# Altium schematic sheet 24VBuckBoostConverterSM.SchDoc
size A; SheetNumber: 5; SheetTotal: 7; SPICEModelCacheDWFIXPQE: <root> / <DocumentId>DWFIXPQE</DocumentId> / </root>
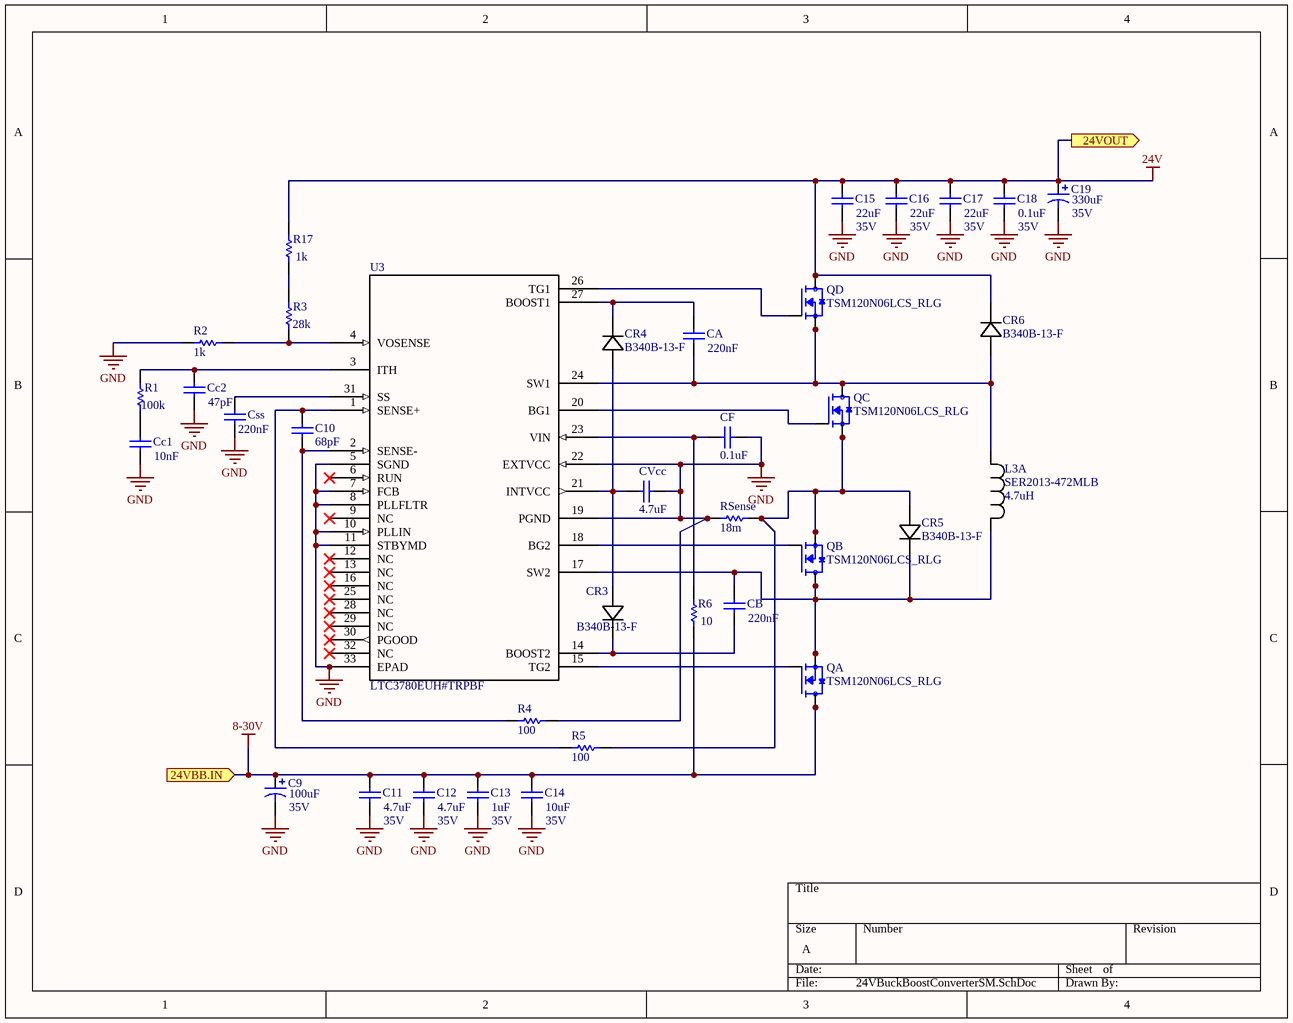
[diagram p0: 24VBuckBoostConverterSM.SchDoc]

## Parts
C9  value 100uF  Voltage Rating: 35V  [RB7.6-15]  (hidden comment: Cap Pol1)
C10  value 68pF  [RAD-0.1]  (hidden comment: Cap)
C11  value 4.7uF  Voltage Rating: 35V  [RAD-0.3]  (hidden comment: Cap)
C12  value 4.7uF  Voltage Rating: 35V  [RAD-0.3]  (hidden comment: Cap)
C13  value 1uF  Voltage Rating: 35V  [RAD-0.3]  (hidden comment: Cap)
C14  value 10uF  Voltage Rating: 35V  [RAD-0.3]  (hidden comment: Cap)
C15  value 22uF  Voltage Rating: 35V  [RAD-0.3]  (hidden comment: Cap)
C16  value 22uF  Voltage Rating: 35V  [RAD-0.3]  (hidden comment: Cap)
C17  value 22uF  Voltage Rating: 35V  [RAD-0.3]  (hidden comment: Cap)
C18  value 0.1uF  Voltage Rating: 35V  [RAD-0.3]  (hidden comment: Cap)
C19  value 330uF  Voltage Rating: 35V  [RB7.6-15]  (hidden comment: Cap Pol1)
CA  value 220nF  [RAD-0.1]  (hidden comment: Cap)
CB  value 220nF  [RAD-0.1]  (hidden comment: Cap)
Cc1  value 10nF  [RAD-0.1]  (hidden comment: Cap)
Cc2  value 47pF  [RAD-0.2]  (hidden comment: Cap)
CF  value 0.1uF  [RAD-0.1]  (hidden comment: Cap)
CR3  B340B-13-F  [B340A-13-F]
CR4  B340B-13-F  [B340A-13-F]
CR5  B340B-13-F  [B340A-13-F]
CR6  B340B-13-F  [B340A-13-F]
Css  value 220nF  [RAD-0.1]  (hidden comment: Cap)
CVcc  value 4.7uF  [RAD-0.1]  (hidden comment: Cap)
L3  SER2013-472MLB  value 4.7uH  [SER2013-472MLB]  (part A of 3)
QA  TSM120N06LCS_RLG  [SOP127P600X200-8N]
QB  TSM120N06LCS_RLG  [SOP127P600X200-8N]
QC  TSM120N06LCS_RLG  [SOP127P600X200-8N]
QD  TSM120N06LCS_RLG  [SOP127P600X200-8N]
R1  value 100k  [AXIAL-0.3]  (hidden comment: Res1)
R2  value 1k  [AXIAL-0.3]  (hidden comment: Res1)
R3  value 28k  [AXIAL-0.3]  (hidden comment: Res1)
R4  value 100  [AXIAL-0.3]  (hidden comment: Res1)
R5  value 100  [AXIAL-0.3]  (hidden comment: Res1)
R6  value 10  [AXIAL-0.3]  (hidden comment: Res1)
R17  value 1k  [AXIAL-0.3]  (hidden comment: Res1)
RSense  value 18m  [AXIAL-0.3]  (hidden comment: Res1)
U3  LTC3780EUH#TRPBF  [LTC3780EUH]

## Ports
24VBB.IN (in), 24VOUT (out)

## Nets
8-30V: C9.1 C11.2 C12.2 C13.2 C14.2 QA.5(D) QA.6(D) QA.7(D) QA.8(D) R6.1 ; port 24VBB.IN
24V: C15.2 C16.2 C17.2 C18.2 C19.1 CR6.1 QD.5(D) QD.6(D) QD.7(D) QD.8(D) R17.2 ; port 24VOUT
GND: C9.2 C11.1 C12.1 C13.1 C14.1 C15.1 C16.1 C17.1 C18.1 C19.2 Cc1.1 Cc2.1 CF.1 Css.1 CVcc.1 R2.2 R4.1 RSense.2 U3.5(SGND) U3.7(FCB) U3.8(PLLFLTR) U3.10(PLLIN) U3.11(STBYMD) U3.19(PGND) U3.22(EXTVCC) U3.33(EPAD)
NetC10_1: C10.1 R5.2 U3.1(SENSE+)
NetC10_2: C10.2 R4.2 U3.2(SENSE-)
NetCA_1: CA.1 CR6.2 L3.2 QC.5(D) QC.6(D) QC.7(D) QC.8(D) QD.1(S) QD.2(S) QD.3(S) U3.24(SW1)
NetCA_2: CA.2 CR4.1 U3.27(BOOST1)
NetCB_1: CB.1 CR3.1 U3.14(BOOST2)
NetCB_2: CB.2 CR5.1 L3.1 QA.1(S) QA.2(S) QA.3(S) QB.5(D) QB.6(D) QB.7(D) QB.8(D) U3.17(SW2)
NetCc1_2: Cc1.2 R1.1
NetCc2_2: Cc2.2 R1.2 U3.3(ITH)
NetCF_2: CF.2 R6.2 U3.23(VIN)
NetCR3_2: CR3.2 CR4.2 CVcc.2 U3.21(INTVCC)
NetCR5_2: CR5.2 QB.1(S) QB.2(S) QB.3(S) QC.1(S) QC.2(S) QC.3(S) R5.1 RSense.1
NetCss_2: Css.2 U3.31(SS)
NetQA_4: QA.4(G) U3.15(TG2)
NetQB_4: QB.4(G) U3.18(BG2)
NetQC_4: QC.4(G) U3.20(BG1)
NetQD_4: QD.4(G) U3.26(TG1)
NetR2_1: R2.1 R3.1 U3.4(VOSENSE)
NetR3_2: R3.2 R17.1

Not connected (* = marked no-connect by the designer): U3 6(RUN)* 9(NC)* 12(NC)* 13(NC)* 16(NC)* 25(NC)* 28(NC)* 29(NC)* 30(PGOOD)* 32(NC)*

## Library data of the parts
C9 C19 = Cap Pol1: Polarized Capacitor (Radial); Published: 8-Jun-2000; LatestRevisionDate: 17-Jul-2002; LatestRevisionNote: Re-released for DXP Platform.; PackageReference: RB7.6-15; Publisher: Altium Limited; PackageDescription: Polarized Capacitor (Radial); 2 Leads
C10-C18 CA CB Cc1 Cc2 CF Css CVcc = Cap: Capacitor; Published: 8-Jun-2000; LatestRevisionDate: 17-Jul-2002; LatestRevisionNote: Re-released for DXP Platform.; PackageReference: RAD-0.3; Publisher: Altium Limited; PackageDescription: Radial Cap, Thru-Hole; 2 Leads; 0.3 in Pin Spacing
CR3-CR6 = B340B-13-F: No Description Available; Mfr_Name: Diodes Inc; Type: DEV; Copyright: Copyright (C) 2022 Ultra Librarian. All rights reserved.; Manufacturer_Part_Number: B340B-13-F; Digi-Key_Part_Number_1: B340B-FDITR-ND; Digi-Key_Part_Number_2: B340B-FDIDKR-ND; Digi-Key_Part_Number_3: B340B-FDICT-ND; RefDes: RefDes
L3 = SER2013-472MLB: No Description Available; Mfr_Name: Coilcraft; Type: DEV; Copyright: Copyright (C) 2022 Ultra Librarian. All rights reserved.; Manufacturer_Part_Number: SER2013-472MLB; RefDes: RefDes
QA QB QC QD = TSM120N06LCS_RLG: 60V, 23A, Single N-Channel Power MOSFET; MF: Taiwan Semiconductor; MP: TSM120N06LCS RLG; Value: *; Purchase-URL: https://pricing.snapeda.com/search/part/TSM120N06LCS RLG/?ref=eda; Digi-Key_Part_Number: TSM120N06LCSRLGTR-ND; Package: SOP-8 Taiwan Semiconductor; SnapEDA_Link: https://www.snapeda.com/parts/TSM120N06LCS%20RLG/Taiwan+Semiconductor/view-part/?ref=snap; Check_prices: https://www.snapeda.com/parts/TSM120N06LCS%20RLG/Taiwan+Semiconductor/view-part/?ref=eda
R1-R6 R17 RSense = Res1: Resistor; Published: 8-Jun-2000; LatestRevisionDate: 17-Jul-2002; LatestRevisionNote: Re-released for DXP Platform.; PackageReference: AXIAL-0.3; Publisher: Altium Limited; PackageDescription: Axial Device, Thru-Hole; 2 Leads; 0.3 in Pin Spacing